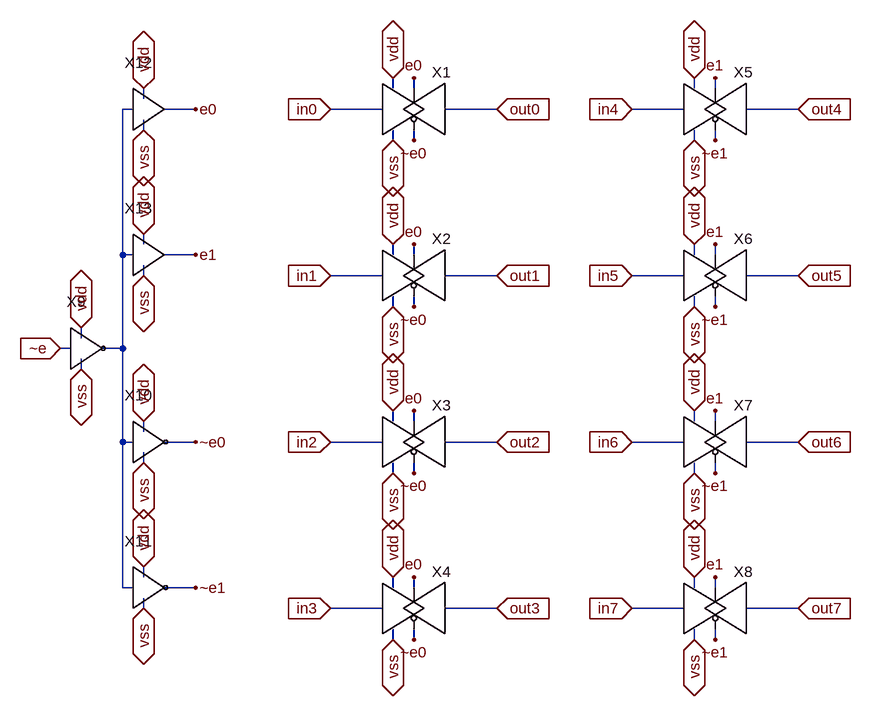
[diagram p0: schematic 8_bit_transmission_gate.asc]
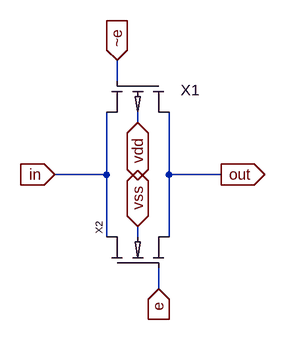
[diagram p1: sub-circuit transmission_gate.asc]
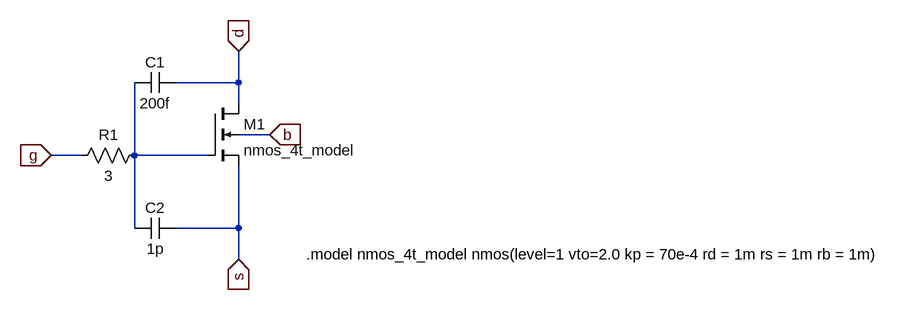
[diagram p2: sub-circuit nmos_4t.asc]
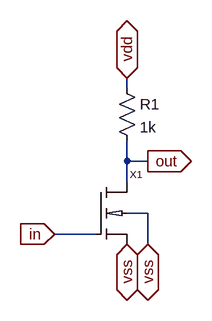
[diagram p3: sub-circuit not.asc]
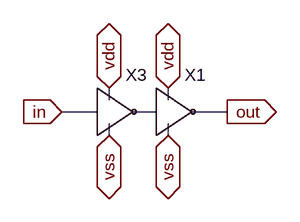
[diagram p4: sub-circuit buffer.asc]
8_bit_transmission_gate.asc, the LTspice schematic file:
Version 4
SHEET 1 880 2080
WIRE 64 112 64 96
WIRE 96 112 96 96
WIRE 528 112 528 96
WIRE 560 112 560 96
WIRE -320 128 -320 112
WIRE -336 144 -352 144
WIRE -240 144 -288 144
WIRE 48 144 -32 144
WIRE 224 144 144 144
WIRE 512 144 432 144
WIRE 688 144 608 144
WIRE -320 176 -320 160
WIRE 64 192 64 176
WIRE 96 192 96 176
WIRE 528 192 528 176
WIRE 560 192 560 176
WIRE -320 352 -320 336
WIRE -352 368 -352 144
WIRE -336 368 -352 368
WIRE -240 368 -288 368
WIRE 64 368 64 352
WIRE 96 368 96 352
WIRE 528 368 528 352
WIRE 560 368 560 352
WIRE -320 400 -320 384
WIRE 48 400 -32 400
WIRE 224 400 144 400
WIRE 512 400 432 400
WIRE 688 400 608 400
WIRE 64 448 64 432
WIRE 96 448 96 432
WIRE 528 448 528 432
WIRE 560 448 560 432
WIRE -416 496 -416 480
WIRE -432 512 -448 512
WIRE -352 512 -352 368
WIRE -352 512 -384 512
WIRE -416 544 -416 528
WIRE 64 624 64 608
WIRE 96 624 96 608
WIRE 528 624 528 608
WIRE 560 624 560 608
WIRE -320 640 -320 624
WIRE -352 656 -352 512
WIRE -336 656 -352 656
WIRE -240 656 -288 656
WIRE 48 656 -32 656
WIRE 224 656 144 656
WIRE 512 656 432 656
WIRE 688 656 608 656
WIRE -320 688 -320 672
WIRE 64 704 64 688
WIRE 96 704 96 688
WIRE 528 704 528 688
WIRE 560 704 560 688
WIRE -320 864 -320 848
WIRE -352 880 -352 656
WIRE -336 880 -352 880
WIRE -240 880 -288 880
WIRE 64 880 64 864
WIRE 96 880 96 864
WIRE 528 880 528 864
WIRE 560 880 560 864
WIRE -320 912 -320 896
WIRE 48 912 -32 912
WIRE 224 912 144 912
WIRE 512 912 432 912
WIRE 688 912 608 912
WIRE 64 960 64 944
WIRE 96 960 96 944
WIRE 528 960 528 944
WIRE 560 960 560 944
FLAG -32 144 in0
IOPIN -32 144 In
FLAG 64 96 vdd
IOPIN 64 96 BiDir
FLAG 64 192 vss
IOPIN 64 192 BiDir
FLAG -32 400 in1
IOPIN -32 400 In
FLAG 64 352 vdd
IOPIN 64 352 BiDir
FLAG 64 448 vss
IOPIN 64 448 BiDir
FLAG -32 656 in2
IOPIN -32 656 In
FLAG 64 608 vdd
IOPIN 64 608 BiDir
FLAG 64 704 vss
IOPIN 64 704 BiDir
FLAG 224 144 out0
IOPIN 224 144 In
FLAG 224 400 out1
IOPIN 224 400 In
FLAG 224 656 out2
IOPIN 224 656 In
FLAG -32 912 in3
IOPIN -32 912 In
FLAG 64 864 vdd
IOPIN 64 864 BiDir
FLAG 64 960 vss
IOPIN 64 960 BiDir
FLAG 224 912 out3
IOPIN 224 912 In
FLAG 432 144 in4
IOPIN 432 144 In
FLAG 528 96 vdd
IOPIN 528 96 BiDir
FLAG 528 192 vss
IOPIN 528 192 BiDir
FLAG 688 144 out4
IOPIN 688 144 In
FLAG 432 400 in5
IOPIN 432 400 In
FLAG 528 352 vdd
IOPIN 528 352 BiDir
FLAG 528 448 vss
IOPIN 528 448 BiDir
FLAG 688 400 out5
IOPIN 688 400 In
FLAG 432 656 in6
IOPIN 432 656 In
FLAG 528 608 vdd
IOPIN 528 608 BiDir
FLAG 528 704 vss
IOPIN 528 704 BiDir
FLAG 688 656 out6
IOPIN 688 656 In
FLAG 432 912 in7
IOPIN 432 912 In
FLAG 528 864 vdd
IOPIN 528 864 BiDir
FLAG 528 960 vss
IOPIN 528 960 BiDir
FLAG 688 912 out7
IOPIN 688 912 In
FLAG -416 480 vdd
IOPIN -416 480 BiDir
FLAG -416 544 vss
IOPIN -416 544 BiDir
FLAG -448 512 ~e
IOPIN -448 512 In
FLAG -320 400 vss
IOPIN -320 400 BiDir
FLAG -320 336 vdd
IOPIN -320 336 BiDir
FLAG -320 688 vss
IOPIN -320 688 BiDir
FLAG -320 624 vdd
IOPIN -320 624 BiDir
FLAG -320 912 vss
IOPIN -320 912 BiDir
FLAG -320 848 vdd
IOPIN -320 848 BiDir
FLAG -320 176 vss
IOPIN -320 176 BiDir
FLAG -320 112 vdd
IOPIN -320 112 BiDir
FLAG -240 144 e0
FLAG -240 368 e1
FLAG -240 656 ~e0
FLAG 96 192 ~e0
FLAG 96 96 e0
FLAG 96 448 ~e0
FLAG 96 352 e0
FLAG -240 880 ~e1
FLAG 96 704 ~e0
FLAG 96 960 ~e0
FLAG 96 608 e0
FLAG 96 864 e0
FLAG 560 96 e1
FLAG 560 352 e1
FLAG 560 608 e1
FLAG 560 864 e1
FLAG 560 960 ~e1
FLAG 560 704 ~e1
FLAG 560 448 ~e1
FLAG 560 192 ~e1
SYMBOL transmission_gate 96 144 R0
WINDOW 0 43 -41 Bottom 2
SYMATTR InstName X1
SYMBOL transmission_gate 96 400 R0
WINDOW 0 43 -41 Bottom 2
SYMATTR InstName X2
SYMBOL transmission_gate 96 656 R0
WINDOW 0 43 -41 Bottom 2
SYMATTR InstName X3
SYMBOL transmission_gate 96 912 R0
WINDOW 0 43 -41 Bottom 2
SYMATTR InstName X4
SYMBOL transmission_gate 560 144 R0
WINDOW 0 43 -41 Bottom 2
SYMATTR InstName X5
SYMBOL transmission_gate 560 400 R0
WINDOW 0 43 -41 Bottom 2
SYMATTR InstName X6
SYMBOL transmission_gate 560 656 R0
WINDOW 0 43 -41 Bottom 2
SYMATTR InstName X7
SYMBOL transmission_gate 560 912 R0
WINDOW 0 43 -41 Bottom 2
SYMATTR InstName X8
SYMBOL not -432 512 R0
SYMATTR InstName X9
SYMBOL buffer -336 144 R0
SYMATTR InstName X12
SYMBOL not -336 656 R0
SYMATTR InstName X10
SYMBOL not -336 880 R0
SYMATTR InstName X11
SYMBOL buffer -336 368 R0
SYMATTR InstName X13

transmission_gate.asc, the sub-circuit schematic file:
Version 4
SHEET 1 880 680
WIRE 208 16 208 -16
WIRE 240 80 240 64
WIRE 192 160 192 64
WIRE 192 160 112 160
WIRE 288 160 288 64
WIRE 368 160 288 160
WIRE 192 256 192 160
WIRE 240 256 240 240
WIRE 288 256 288 160
WIRE 272 336 272 304
FLAG 112 160 in
IOPIN 112 160 In
FLAG 272 336 e
IOPIN 272 336 In
FLAG 368 160 out
IOPIN 368 160 Out
FLAG 208 -16 ~e
IOPIN 208 -16 In
FLAG 240 80 vdd
IOPIN 240 80 BiDir
FLAG 240 240 vss
IOPIN 240 240 BiDir
SYMBOL pmos_4t 288 16 R90
WINDOW 0 14 -47 VRight 2
SYMATTR InstName X1
SYMBOL nmos_4t 192 304 R270
SYMATTR InstName X2

nmos_4t.asc, the sub-circuit schematic file:
Version 4
SHEET 1 880 680
WIRE -288 -224 -288 -272
WIRE -288 -224 -384 -224
WIRE -288 -192 -288 -224
WIRE -240 -144 -288 -144
WIRE -528 -112 -576 -112
WIRE -448 -112 -448 -224
WIRE -336 -112 -448 -112
WIRE -448 0 -448 -112
WIRE -288 0 -288 -96
WIRE -288 0 -384 0
WIRE -288 48 -288 0
FLAG -576 -112 g
IOPIN -576 -112 In
FLAG -288 -272 d
IOPIN -288 -272 In
FLAG -288 48 s
IOPIN -288 48 In
FLAG -240 -144 b
IOPIN -240 -144 In
SYMBOL nmos4 -336 -192 R0
SYMATTR InstName M1
SYMATTR Value nmos_4t_model
SYMBOL cap -384 -240 R90
WINDOW 0 0 32 VBottom 2
WINDOW 3 32 32 VTop 2
SYMATTR InstName C1
SYMATTR Value 200f
SYMBOL cap -384 -16 R90
WINDOW 0 0 32 VBottom 2
WINDOW 3 32 32 VTop 2
SYMATTR InstName C2
SYMATTR Value 1p
SYMBOL res -432 -128 R90
WINDOW 0 0 56 VBottom 2
WINDOW 3 32 56 VTop 2
SYMATTR InstName R1
SYMATTR Value 3
TEXT -184 40 Left 2 !.model nmos_4t_model nmos(level=1 vto=2.0 kp = 70e-4 rd = 1m rs = 1m rb = 1m)

not.asc, the sub-circuit schematic file:
Version 4
SHEET 1 880 680
WIRE 176 -96 176 -112
WIRE 176 16 176 -16
WIRE 208 16 176 16
WIRE 176 48 176 16
WIRE 208 96 176 96
WIRE 128 128 64 128
WIRE 208 144 208 96
FLAG 64 128 in
IOPIN 64 128 In
FLAG 176 144 vss
IOPIN 176 144 BiDir
FLAG 176 -112 vdd
IOPIN 176 -112 BiDir
FLAG 208 16 out
IOPIN 208 16 Out
FLAG 208 144 vss
IOPIN 208 144 BiDir
SYMBOL res 160 -112 R0
SYMATTR InstName R1
SYMATTR Value 1k
SYMBOL nmos_4t 128 48 R0
SYMATTR InstName X1

buffer.asc, the sub-circuit schematic file:
Version 4
SHEET 1 880 680
WIRE -48 48 -48 32
WIRE 32 48 32 32
WIRE -64 64 -112 64
WIRE 16 64 -16 64
WIRE 112 64 64 64
WIRE -48 96 -48 80
WIRE 32 96 32 80
FLAG -112 64 in
IOPIN -112 64 In
FLAG -48 32 vdd
IOPIN -48 32 BiDir
FLAG 112 64 out
IOPIN 112 64 Out
FLAG -48 96 vss
IOPIN -48 96 BiDir
FLAG 32 96 vss
IOPIN 32 96 BiDir
FLAG 32 32 vdd
IOPIN 32 32 BiDir
SYMBOL not -64 64 R0
WINDOW 0 53 -34 Bottom 2
SYMATTR InstName X3
SYMBOL not 16 64 R0
WINDOW 0 53 -34 Bottom 2
SYMATTR InstName X1

The netlist it stands for:
* 8_bit_transmission_gate.asc
XX1 e0 in0 ~e0 out0 vdd vss transmission_gate
XX2 e0 in1 ~e0 out1 vdd vss transmission_gate
XX3 e0 in2 ~e0 out2 vdd vss transmission_gate
XX4 e0 in3 ~e0 out3 vdd vss transmission_gate
XX5 e1 in4 ~e1 out4 vdd vss transmission_gate
XX6 e1 in5 ~e1 out5 vdd vss transmission_gate
XX7 e1 in6 ~e1 out6 vdd vss transmission_gate
XX8 e1 in7 ~e1 out7 vdd vss transmission_gate
XX9 ~e N001 vss vdd not
XX12 N001 e0 vss vdd buffer
XX10 N001 ~e0 vss vdd not
XX11 N001 ~e1 vss vdd not
XX13 N001 e1 vss vdd buffer

* block symbol definitions
.subckt transmission_gate e in ~e out vdd vss
XX1 out ~e in vdd pmos_4t  ; pins D G S B
XX2 in e out vss nmos_4t
.ends transmission_gate

.subckt nmos_4t D G S B
M1 d N001 s b nmos_4t_model
C1 d N001 200f
C2 s N001 1p
R1 N001 g 3
.model nmos_4t_model nmos(level=1 vto=2.0 kp = 70e-4 rd = 1m rs = 1m rb = 1m)
.ends nmos_4t

.subckt not in out vss vdd
R1 vdd out 1k
XX1 out in vss vss nmos_4t
.ends not

.subckt buffer in out vss vdd
XX3 in N001 vss vdd not
XX1 N001 out vss vdd not
.ends buffer

.model NMOS NMOS
.model PMOS PMOS
.lib standard.mos
.backanno
.end